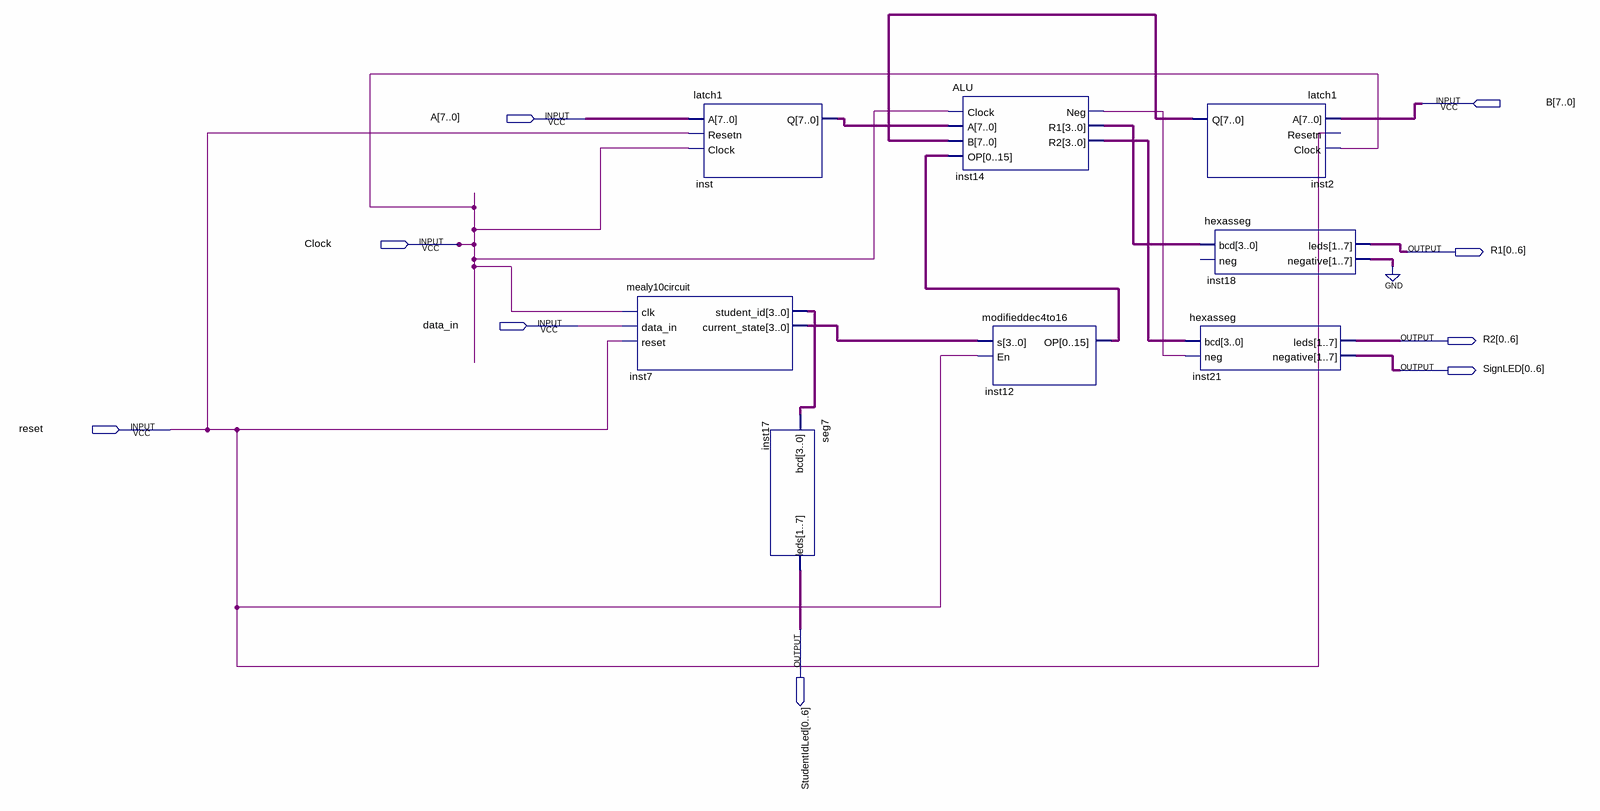
[diagram p0: schematic sheet]
// Quartus schematic GPP.bdf as structural Verilog: 8 symbols, 9 pins
module GPP (
  input  [7:0] B,
  input  [7:0] A,
  input  Clock,
  input  data_in,
  input  reset,
  output [0:6] R1,
  output [0:6] R2,
  output [0:6] SignLED,
  output [0:6] StudentIdLed
);

  wire inst14_neg;
  wire [3:0] inst7_current_state, inst7_student_id, inst14_r1, inst14_r2;
  wire [6:0] inst18_negative;
  wire [7:0] inst2_q, inst_q;
  wire [15:0] inst12_op;

  mealy10circuit inst7 (
    .clk(Clock), .data_in(data_in), .reset(reset), .student_id(inst7_student_id),
    .current_state(inst7_current_state));
  latch1 inst (.A(A), .Resetn(reset), .Clock(Clock), .Q(inst_q));
  seg7 inst17 (.bcd(inst7_student_id), .leds(StudentIdLed));
  ALU inst14 (.Clock(Clock), .A(inst_q), .B(inst2_q), .OP(inst12_op), .Neg(inst14_neg), .R1(inst14_r1), .R2(inst14_r2));
  modifieddec4to16 inst12 (.s(inst7_current_state), .En(reset), .OP(inst12_op));
  hexasseg inst21 (.bcd(inst14_r2), .neg(inst14_neg), .leds(R2), .negative(SignLED));
  latch1 inst2 (.A(B), .Resetn(reset), .Clock(Clock), .Q(inst2_q));
  hexasseg inst18 (.bcd(inst14_r1), .leds(R1), .negative(inst18_negative));  // open: neg
  // also tied to GND on the sheet: {inst18_negative[0], inst18_negative[1], inst18_negative[2], inst18_negative[3], inst18_negative[4], inst18_negative[5], inst18_negative[6]}
endmodule
